# EAGLE design SOT23-3 to AVR Parttester (EAGLE 6.1)
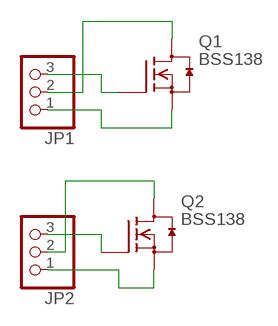
[diagram p0: schematic, sheet 1]

## Parts
JP1  PINHD-1X3  [1X03]
JP2  PINHD-1X3  [1X03]
Q1  BSS138  [SOT23]
Q2  BSS138  [SOT23]

## Nets
1: JP1.3 Q1.1(G)
2: JP1.2 Q1.3(D)
3: JP1.1 Q1.2(S)
11: JP2.3 Q2.1(G)
22: JP2.2 Q2.3(D)
33: JP2.1 Q2.2(S)

## Library data of the parts
JP1 JP2 = pinhead:PINHD-1X3: PIN HEADER
Q1 Q2 = m-pad-2.1:BSS138: Fairchild Semiconductors BSS138 N-Channel Logic Level Enhancement Mode Field Effect Transistor General Description: These N-Channel enhancement mode field effect transistors are produced using Fairchild's proprietary, high cell density, DMOS technology. These products have been designed to minimize on-state resistance while provide rugged, reliable, and fast switching performance.These products are particularly suited for low voltage, low current applications such as small servo motor control, power MOSFET gate drivers, and other switching applications. Features: 0.22 A, 50 V. RDS(ON) = 3.5Ohm @ VGS = 10 V RDS(ON) = 6.0Ohm @ VGS = 4.5 V High density cell design for extremely low RDS(ON) Rugged and Reliable Compact industry standard SOT-23 surface mount package Please send any comments to: messi@users.sourceforge.net

## Board
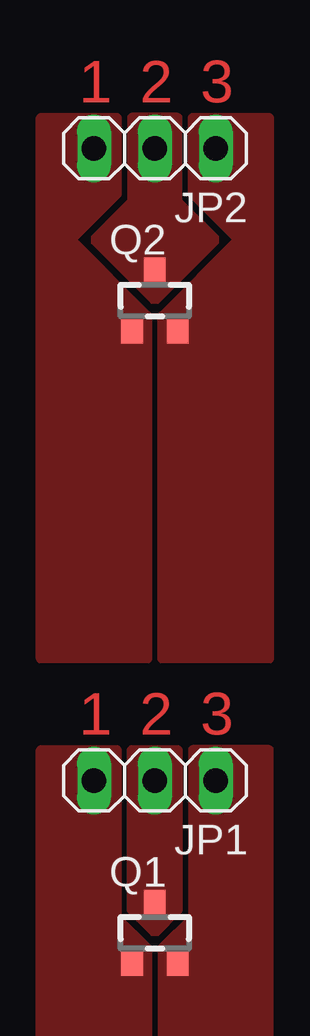
[diagram p1: board, top side]

No outline drawn. Coordinates in mm, seen from the top.
Copper layers (1*16): Top 0.035mm / dielectric 1.5mm / Bottom 0.035mm
Design rules: minimum track width 6mil, minimum drill 12mil, track to track 6mil, track to pad 6mil, pad to pad 6mil, via to via 6mil, smd to smd 6mil, copper to edge 20mil, drill to drill 8mil, minimum pad ring 8mil, minimum via ring 6mil, stop-mask expansion 3mil, vias tented up to drill 0mil, thermal gap 8mil

### Footprints (pad centres in the part's own frame; a part is rotated, then mirrored left to right if it is on the bottom)
1X03 = drill 1.016 long: 1 -2.54,0; 2 0,0; 3 2.54,0
SOT23 = smd 0.9 x 1.2: 1 -0.95,-1.2; 2 0.95,-1.2; 3 0,1.2

### Placement (x,y rotation side)
JP1  17.14,-6.99 180 top
JP2  17.14,19.37 180 top
Q1  17.14,-13.34 0 top
Q2  17.14,13.02 0 top

### Tracks (layer width: path | path; a pad name or v marks a point on that pad's centre or on a via)
1
  pour Top (no thermals): 16.83,-13.97 16.83,-24.77 12.38,-24.77 12.38,-5.71 15.56,-5.71 15.56,-12.7
2
  pour Top (no thermals): 16.19,-5.71 18.1,-5.71 18.1,-12.38 17.14,-13.34 16.19,-12.38
3
  pour Top (no thermals): 17.46,-13.97 17.46,-24.77 21.91,-24.77 21.91,-5.71 18.73,-5.71 18.73,-12.7
11
  pour Top (no thermals): 15.56,20.64 15.56,17.46 13.65,15.56 16.83,12.38 16.83,-1.91 12.38,-1.91 12.38,20.64
22
  pour Top (no thermals): 16.19,20.64 16.19,17.14 14.61,15.56 17.14,13.02 19.68,15.56 18.1,17.14 18.1,20.64
33
  pour Top (no thermals): 21.91,20.64 21.91,-1.91 17.46,-1.91 17.46,12.38 20.64,15.56 18.73,17.46 18.73,20.64

### Text on the board
Top: 1 | 2 | 3 | 1 | 2 | 3